# Altium schematic sheet Bluetooth.SchDoc
size 386 x 246 mm
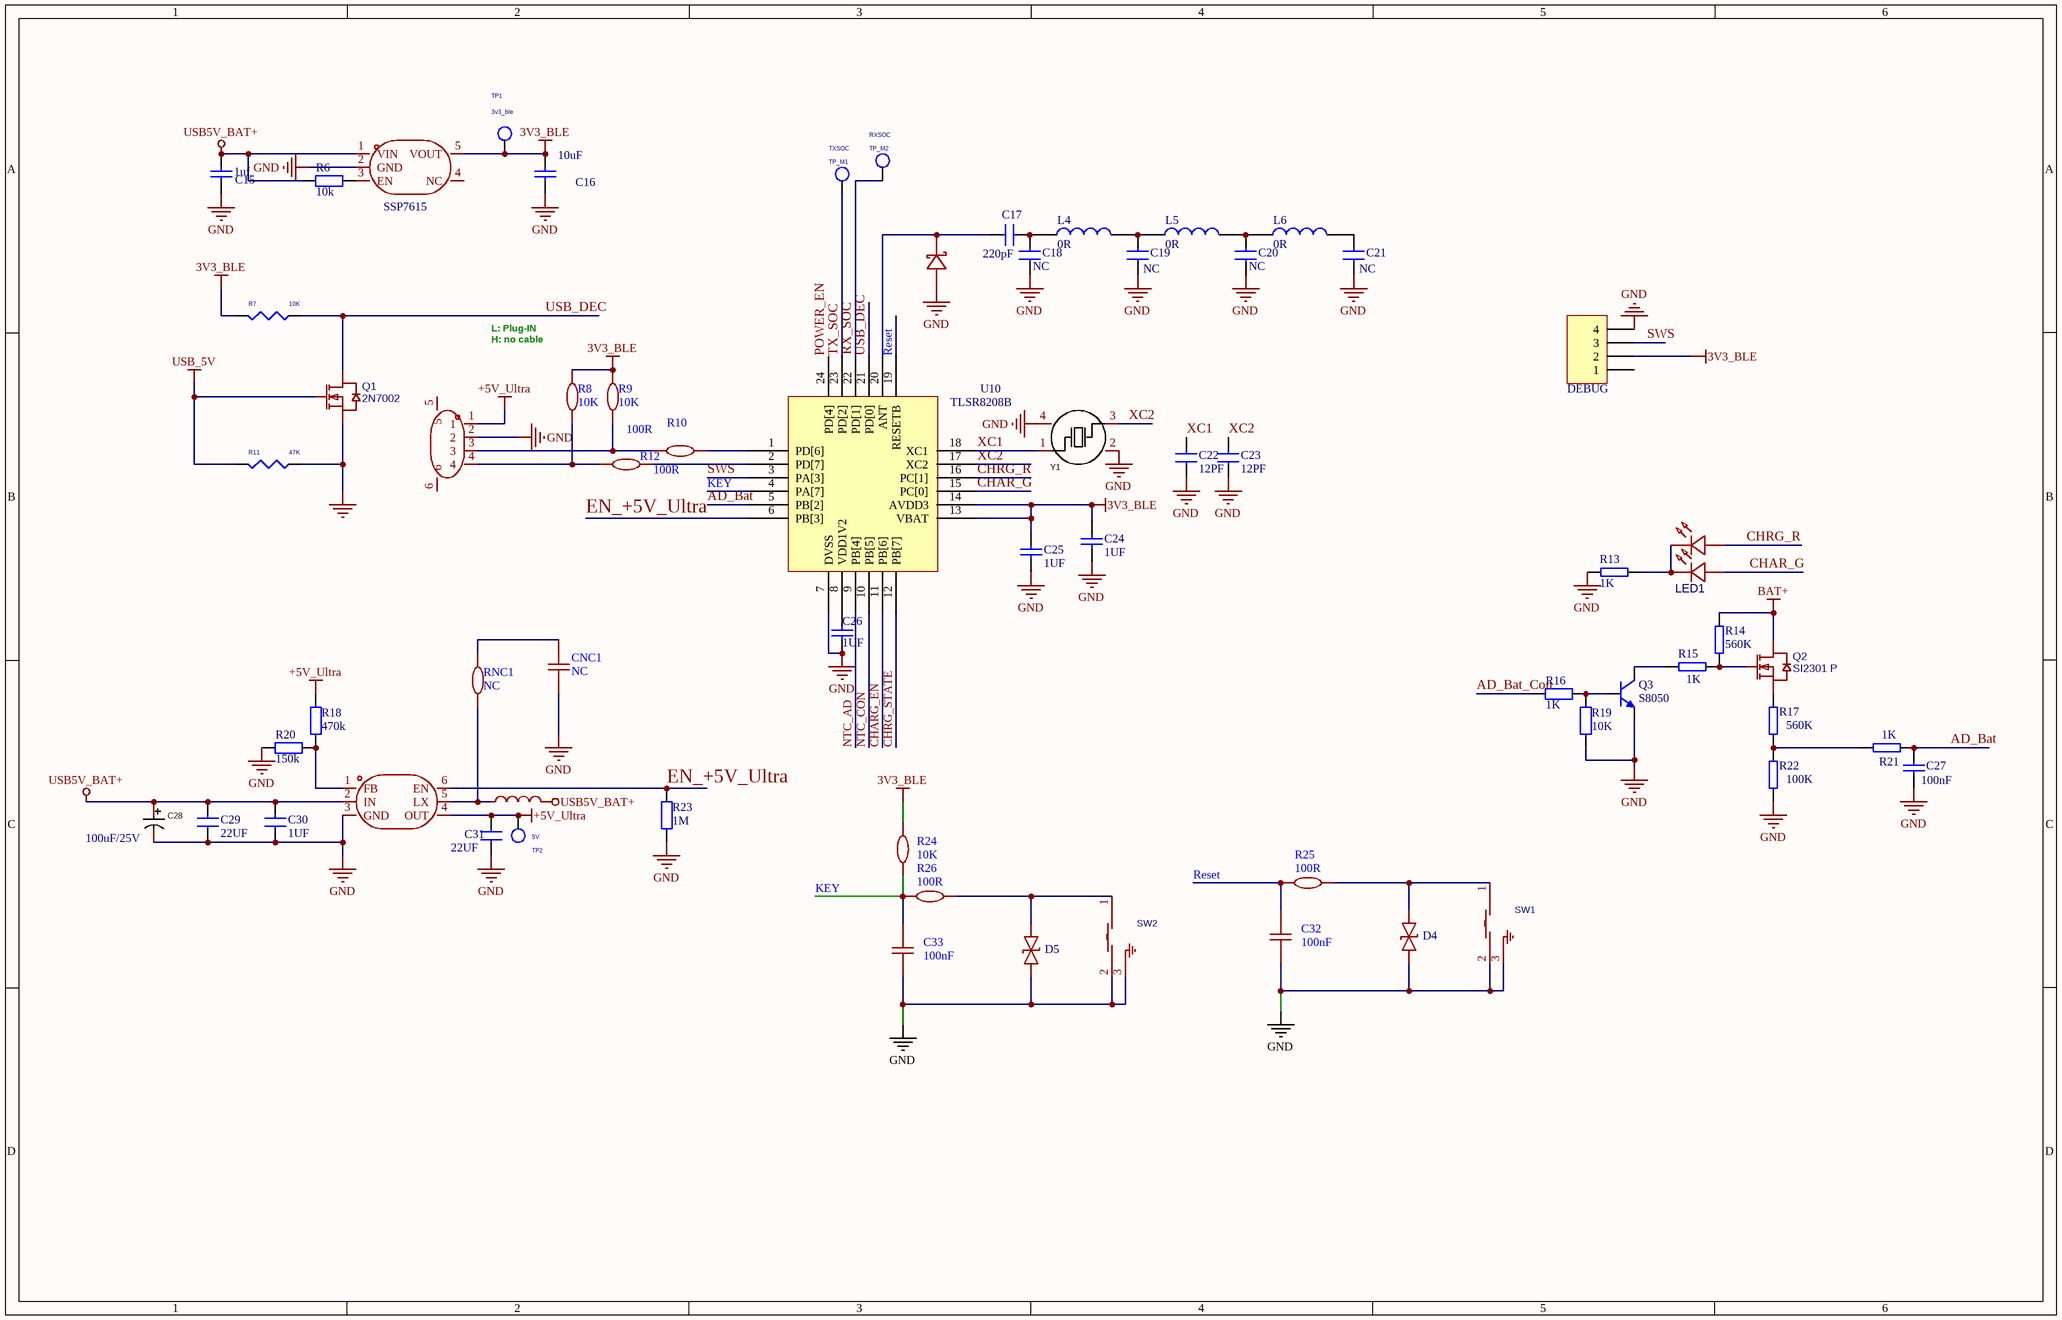
[diagram p0: Bluetooth.SchDoc]

## Parts
C15  1uf  [0603_C]
C16  10uF  [0603_C]
C17  220pF  [0402_c]
C18  NC  [0402_C]
C19  NC  [0402_C]
C20  NC  [0402_C]
C21  NC  [0402_C]
C22  12PF  [0603_c]
C23  12PF  [0603_c]
C24  1UF  [0603_c]
C25  1UF  [0603_c]
C26  1UF  [0603_c]
C27  100nF  [c0402]
C28  100uF/25V  [SMD 6.3*5.4 电解]
C29  22UF  [0805_c]
C30  1UF  [0402_c]
C31  22UF  [0805_c]
C32  100nF  [c0402]
C33  100nF  [c0402]
CNC1  NC  [c0402]
CON4  Ultra  [CONN-SMD_4P-P1.25_LT]  (value not drawn)
D3  SE6V3LHN102T 6.3v单向  [0402-D]  (value not drawn)
D4  LESD5Z5.0CT1G  [SOD-523_L1.2-W0.8-LS1.6-BI]  (value not drawn)
D5  LESD5Z5.0CT1G  [SOD-523_L1.2-W0.8-LS1.6-BI]  (value not drawn)
L4  0R  [0402_R]
L5  0R  [0402_R]
L6  0R  [0402_R]
L7  SLW3012P1R5MST SMD3.0*3.0  [IND-SMD_L3.0-W3.0]  (value not drawn)
LED1  *  [LED-SMD_4P-L3.2-W1.6-TL_XL-3216SURUGC]  (value not drawn)
P1  DEBUG  [SIP4-2.54]
Q1  2N7002  [SOT-23]
Q2  SI2301 P  [SOT-23]
Q3  S8050  [SOT-23(SOT-23-3)]
R6  10k  [R0402]
R7  10K  [R0402]
R8  10K  [R0402]
R9  10K  [R0402]
R10  100R  [R0402]
R11  47K  [R0402]
R12  100R  [R0402]
R13  1K  [0603_R]
R14  560K  [R0402]
R15  1K  [R0402]
R16  1K  [R0402]
R17  560K  [R0402]
R18  470k  [0402_r]
R19  10K  [R0402]
R20  150k  [0402_r]
R21  1K  [R0402]
R22  100K  [R0402]
R23  1M  [0402_r]
R24  10K  [R0402]
R25  100R  [R0402]
R26  100R  [R0402]
RNC1  NC  [R0402]
SW1  Reset  [SMD-KEY-3]  (value not drawn)
SW2  OnOff  [SMD-KEY-3]  (value not drawn)
TP1  3v3_ble  [TP]
TP2  5V  [TP]
TP_M1  TXSOC  [TP]
TP_M2  RXSOC  [TP]
U2  SSP7615  [SOT-23-5]
U3  SY7069ADC  [SOT-23-6]  (value not drawn)
U10  TLSR8208B  [QFN-24-EP(4*4)]
Y1  24MHz +-20PPM  [CRYSTAL-SMD_4P-L3.2-W2.5]  (value not drawn)

## Nets
3V3_BLE: C16.2 C24.1 C25.1 P1.2 R7.1 R8.1 R9.1 R24.2 TP1.1(TP) U2.5(VOUT) U10.13(VBAT) U10.14(AVDD3)
+5V_Ultra: C31.2 CON4.1 R18.2 TP2.1(TP) U3.4(OUT)
BAT+: Q2.2(D) R14.1
GND: C15.1 C16.1 C18.1 C19.1 C20.1 C21.1 C22.1 C23.1 C24.2 C25.2 C26.1 C27.1 C28.2 C29.1 C30.1 C31.1 C32.1 C33.1 CNC1.1 CON4.2 D3.2(A) D4.1 D5.1 P1.4 Q1.2(S) Q3.2(E) R11.2 R13.1 R19.1 R20.2 R22.2 R23.1 SW1.2 SW1.3 SW2.2 SW2.3 U2.2(GND) U3.3(GND) U10.7(DVSS) Y1.2(GND) Y1.4(GND)
USB5V_BAT+: C15.2 C28.1 C29.2 C30.2 L7.2 R6.1 U2.1(VIN) U3.2(IN)
USB_5V: Q1.1(G) R11.1
AD_Bat: C27.2 R21.1 U10.5(PB[2])
AD_Bat_Con: R16.2
CHAR_G: LED1.3(A) U10.15(PC[0])
CHARG_EN: U10.11(PB[6])
CHRG_R: LED1.1(A) U10.16(PC[1])
CHRG_STATE: U10.12(PB[7])
EN_+5V_Ultra: R23.2 U3.6(EN) U10.6(PB[3])
KEY: C33.2 R24.1 R26.2 U10.4(PA[7])
NTC_AD: U10.9(PB[4])
NTC_CON: U10.10(PB[5])
POWER_EN: U10.24(PD[4])
Reset: C32.2 R25.2 U10.19(RESETB)
RX_SOC: TP_M2.1(TP) U10.22(PD[1])
SWS: P1.3 U10.3(PA[3])
TX_SOC: TP_M1.1(TP) U10.23(PD[2])
USB_DEC: Q1.3(D) R7.2 U10.21(PD[0])
XC1: C22.2 U10.18(XC1) Y1.1(OSC1)
XC2: C23.2 U10.17(XC2) Y1.3(OSC2)
NetC17_1: C17.1 D3.1(C) U10.20(ANT)
NetC17_2: C17.2 C18.2 L4.1
NetC19_2: C19.2 L4.2 L5.1
NetC20_2: C20.2 L5.2 L6.1
NetC21_2: C21.2 L6.2
NetC26_2: C26.2 U10.8(VDD1V2)
NetCNC1_2: CNC1.2 RNC1.1
NetCON4_3: CON4.3 R9.2 R10.2
NetCON4_4: CON4.4 R8.2 R12.2
NetD4_2: D4.2 R25.1 SW1.1
NetD5_2: D5.2 R26.1 SW2.1
NetL7_1: L7.1 RNC1.2 U3.5(LX)
NetLED1_2: LED1.2(K) LED1.4(K) R13.2
NetQ2_1: Q2.1(G) R14.2 R15.1
NetQ2_3: Q2.3(S) R17.1
NetQ3_1: Q3.1(B) R16.1 R19.2
NetQ3_3: Q3.3(C) R15.2
NetR6_2: R6.2 U2.3(EN)
NetR10_1: R10.1 U10.1(PD[6])
NetR12_1: R12.1 U10.2(PD[7])
NetR17_2: R17.2 R21.2 R22.1
NetR18_1: R18.1 R20.1 U3.1(FB)

Not connected (* = marked no-connect by the designer): CON4 5 6; P1 1; U2 4(NC)

## Notes on the sheet
- L: Plug-IN
  H: no cable

## Library data of the parts
C15 = Cap1: 无极电容
C16 = Cap: Capacitor; Value: 10nF; Published: 8-Jun-2000; Revision: July-2002: Re-released for DXP Platform.; Publisher: Altium Limited
C17-C23 C29-C31 = CAP: Capacitor
C24-C27 = CAP
C28 = RVT1A221M0605_C72494: Symbol: RVT1A221M0605-C72494; Value: 220uF; Add into BOM: yes; Rated Voltage: 10V; Ripple Current: 90mA@120Hz; L: 5.4mm; Device: RVT1A221M0605_C72494; Supplier: LCSC; Manufacturer Part: RVT1A221M0605; Supplier Part: C72494; JLCPCB Part Class: Extended Part; Supplier Footprint: SMD,D6.3xL5.4mm; Datasheet: https://atta.szlcsc.com/upload/public/pdf/source/20170325/1490427950282.pdf; Convert to PCB: yes; Equivalent Series Resistance(ESR): -
C32 C33 = CAP_0603: Symbol: CapAcitance; Convert to PCB: yes; Device: CAP_0603; Add into BOM: yes; Supplier Footprint: 0603; Value: 100nF
CNC1 = CAP_0603: Symbol: CapAcitance; Convert to PCB: yes; Value: 100nF; Device: CAP_0603; Add into BOM: yes; Supplier Footprint: 0603
CON4 = HC-1.25-4PLT: Symbol: HC-1.25-4PLT
D3 = TPNSR05F20NXT5G: Symbol: TPNSR05F20NXT5G
D4 D5 = LESD5Z5.0CT1G: Add into BOM: yes; Reverse Stand-Off Voltage (Vrwm): 5V; Maximum Clamping Voltage: 18.6V; Peak Pulse Current (Ipp)@10/1000us: 9.4A; Breakdown Voltage: 5.6V; Type: ESD; Symbol: LESD5Z5.0CT1G; Device: LESD5Z5.0CT1G; Supplier: LCSC; Manufacturer Part: LESD5Z5.0CT1G; Supplier Part: C136167; Supplier Footprint: SOD-523; Datasheet: https://atta.szlcsc.com/upload/public/pdf/source/20171026/C136167_15089841930291059137.pdf; Convert to PCB: yes
L4-L6 = INDUCTOR
L7 = SLW3012P1R5MST: Symbol: SLW3012P1R5MST
LED1 = TJ-S2012SW8TCGLC2R2G-A5: Symbol: TJ-S2012SW8TCGLC2R2G-A5
P1 = Header 4: Header, 4-Pin; LatestRevisionDate: 17-Jul-2002; LatestRevisionNote: Re-released for DXP Platform.; Publisher: Altium Limited
Q1 Q2 = JMTL3400A: Contributor: LCSC; BOM_Supplier: LCSC; BOM_Supplier Part: C2890442; BOM_Manufacturer Part: JMTL3400A; BOM_JLCPCB Part Class: Extended Part; spicePre: Q; spiceSymbolName: JMTL3400A
Q3 = NPN_sot23: NPN三极管
R6 R16 R18-R20 R23 = Res2: Resistor; Value: 120R; Published: 8-Jun-2000; LatestRevisionDate: 17-Jul-2002; LatestRevisionNote: Re-released for DXP Platform.; PackageReference: AXIAL-0.4; Publisher: Altium Limited
R7 R11 = R_Dup2
R8 R9 RNC1 = Res_0603: Convert to PCB: yes; Value: 100R; Device: Res_0603; Add into BOM: yes; Supplier Footprint: 0603
R10 R12 R24-R26 = Res_0603: Convert to PCB: yes; Device: Res_0603; Add into BOM: yes; Supplier Footprint: 0603
  R10 R12 R25 R26: Value: 100R
  R24: Value: 10K
R13-R15 R17 R21 R22 = RES
SW1 SW2 = K2-1109SE-I4SW-04: Symbol: K2-1109SE-I4SW-04
TP1 TP2 TP_M1 TP_M2 = T POINT R
U2 = SSP7615-33M5R: Symbol: SSP7615-33M5R
Y1 = TAXM13.56M4RLBCCT2T: Name: 13.56MHz; Add into BOM: yes; Value: 13.56MHz; External load capacitor: 20pF; Device: TAXM13.56M4RLBCCT2T; Supplier Part: C164051; Manufacturer Part: TAXM13.56M4RLBCCT2T; Supplier Footprint: SMD3225-4P; JLCPCB Part Class: Extended Part; Datasheet: https://atta.szlcsc.com/upload/public/pdf/source/20171225/C164051_15141924799131203407.pdf; Supplier: LCSC; Convert to PCB: yes
U3 = SY7069ADC: Symbol: SY7069ADC